# EAGLE design BUZZI-46-2 (EAGLE 5.02)
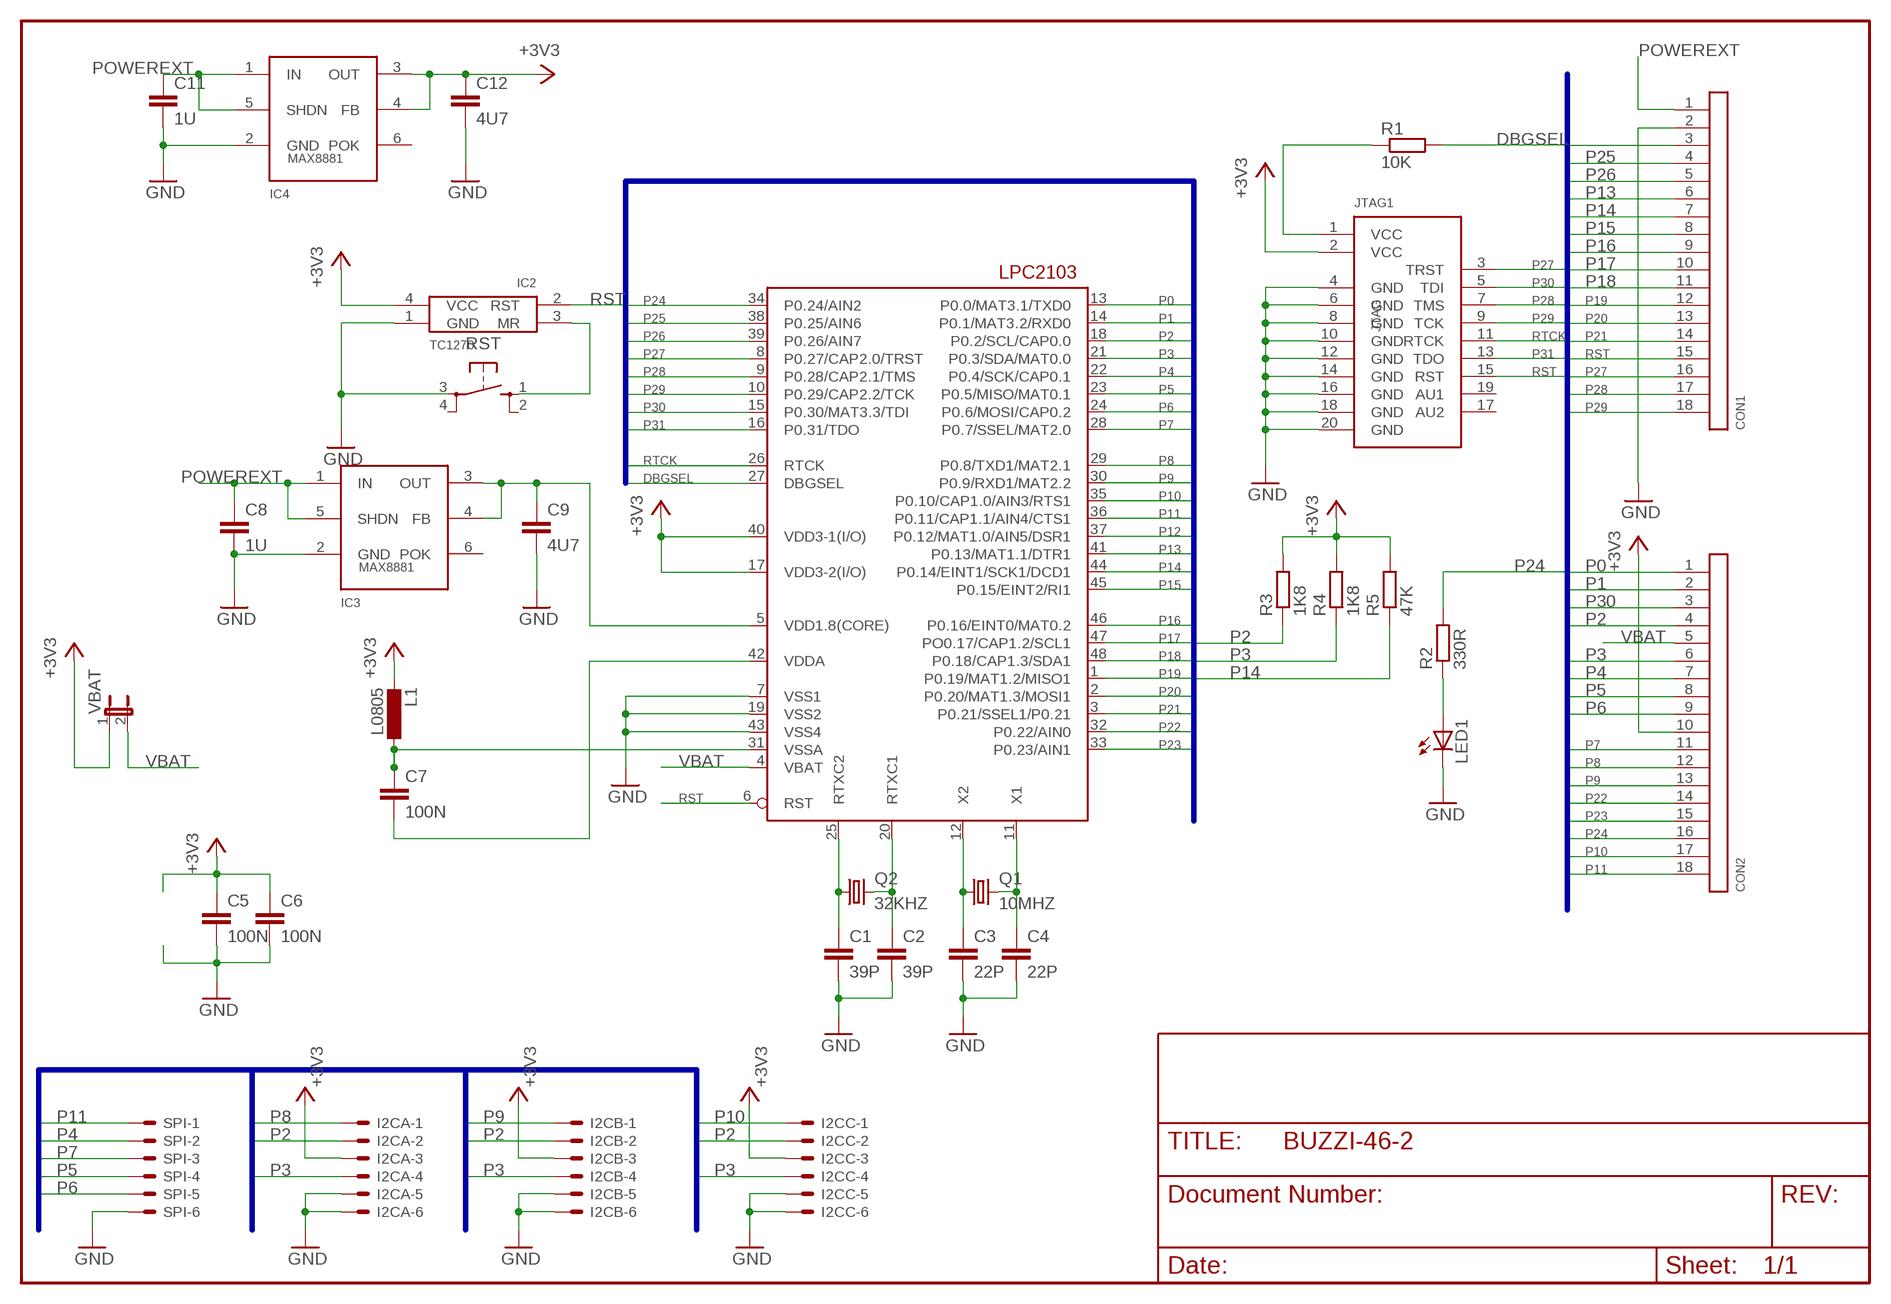
[diagram p0: schematic, sheet 1]

## Parts
C1  39P  C-EUC0603K  [C0603K]
C2  39P  C-EUC0603K  [C0603K]
C3  22P  C-EUC0603K  [C0603K]
C4  22P  C-EUC0603K  [C0603K]
C5  100N  C-EUC0805  [C0805]
C6  100N  C-EUC0805  [C0805]
C7  100N  C-EUC0603  [C0603]
C8  1U  C-EUC0805  [C0805]
C9  4U7  C-EUC0805  [C0805]
C11  1U  C-EUC0805  [C0805]
C12  4U7  C-EUC0805  [C0805]
CON1  CON18  [MA18-1]
CON2  CON18  [MA18-1]
I2CA  22-23-2061  [22-23-2061]
I2CB  22-23-2061  [22-23-2061]
I2CC  22-23-2061  [22-23-2061]
IC1  LPC2103  [LQFP48]
IC2  TC1270  [SOT143R_INFINEON]
IC3  MAX8881-18  MAX8881  [SOT23-6L]
IC4  MAX8881-33  MAX8881  [SOT23-6L]
JTAG1  ARM-JTAGVERTIKAL  [ML20]
L1  L0805  [C0805]
LED1  LEDCHIPLED_0805  [CHIPLED_0805]
Q1  10MHZ  CRYTALHC49S  [HC49/S]
Q2  32KHZ  CRYTALTC26V  [TC26V]
R1  10K  R-EU_M0805  [M0805]
R2  330R  R-EU_M0805  [M0805]
R3  1K8  R-EU_M0805  [M0805]
R4  1K8  R-EU_M0805  [M0805]
R5  47K  R-EU_M0805  [M0805]
RST  10XXSMD  [B3F-10XX-SMD]
SPI  22-23-2061  [22-23-2061]
VBAT  JP1E  [JP1]

## Nets
1V8: C9.1 IC1.5(VDD1.8(CORE)) IC3.3(OUT) IC3.4(FB)
+3V3: C5.1 C6.1 C12.1 CON2.10 I2CA.3 I2CB.3 I2CC.3 IC1.17(VDD3-2(I/O)) IC1.40(VDD3-1(I/O)) IC2.4(VCC) IC4.3(OUT) IC4.4(FB) JTAG1.2(VCC) L1.2 R3.2 R4.2 R5.2 VBAT.1
DBGSEL: IC1.27(DBGSEL) R1.2
GND: C1.2 C2.2 C3.2 C4.2 C5.2 C6.2 C8.2 C9.2 C11.2 C12.2 CON1.2 I2CA.5 I2CA.6 I2CB.5 I2CB.6 I2CC.5 I2CC.6 IC1.7(VSS1) IC1.19(VSS2) IC1.43(VSS4) IC2.1(GND) IC3.2(GND) IC4.2(GND) JTAG1.4(GND) JTAG1.6(GND) JTAG1.8(GND) JTAG1.10(GND) JTAG1.12(GND) JTAG1.14(GND) JTAG1.16(GND) JTAG1.18(GND) JTAG1.20(GND) LED1.C RST.3 SPI.6
N$1: IC2.3(MR) RST.1
N$2: JTAG1.1(VCC) R1.1
N$3: LED1.A R2.1
N$6: C7.1 IC1.31(VSSA) L1.1
N$7: C7.2 IC1.42(VDDA)
P0: CON2.1 IC1.13(P0.0/MAT3.1/TXD0)
P1: CON2.2 IC1.14(P0.1/MAT3.2/RXD0)
P2: CON2.4 I2CA.2 I2CB.2 I2CC.2 IC1.18(P0.2/SCL/CAP0.0) R3.1
P3: CON2.6 I2CA.4 I2CB.4 I2CC.4 IC1.21(P0.3/SDA/MAT0.0) R4.1
P4: CON2.7 IC1.22(P0.4/SCK/CAP0.1) SPI.2
P5: CON2.8 IC1.23(P0.5/MISO/MAT0.1) SPI.4
P6: CON2.9 IC1.24(P0.6/MOSI/CAP0.2) SPI.5
P7: CON2.11 IC1.28(P0.7/SSEL/MAT2.0) SPI.3
P8: CON2.12 I2CA.1 IC1.29(P0.8/TXD1/MAT2.1)
P9: CON2.13 I2CB.1 IC1.30(P0.9/RXD1/MAT2.2)
P10: CON2.17 I2CC.1 IC1.35(P0.10/CAP1.0/AIN3/RTS1)
P11: CON2.18 IC1.36(P0.11/CAP1.1/AIN4/CTS1) SPI.1
P12: CON1.3 IC1.37(P0.12/MAT1.0/AIN5/DSR1)
P13: CON1.6 IC1.41(P0.13/MAT1.1/DTR1)
P14: CON1.7 IC1.44(P0.14/EINT1/SCK1/DCD1) R5.1
P15: CON1.8 IC1.45(P0.15/EINT2/RI1)
P16: CON1.9 IC1.46(P0.16/EINT0/MAT0.2)
P17: CON1.10 IC1.47(PO0.17/CAP1.2/SCL1)
P18: CON1.11 IC1.48(P0.18/CAP1.3/SDA1)
P19: CON1.12 IC1.1(P0.19/MAT1.2/MISO1)
P20: CON1.13 IC1.2(P0.20/MAT1.3/MOSI1)
P21: CON1.14 IC1.3(P0.21/SSEL1/P0.21)
P22: CON2.14 IC1.32(P0.22/AIN0)
P23: CON2.15 IC1.33(P0.23/AIN1)
P24: CON2.16 IC1.34(P0.24/AIN2) R2.2
P25: CON1.4 IC1.38(P0.25/AIN6)
P26: CON1.5 IC1.39(P0.26/AIN7)
P27: CON1.16 IC1.8(P0.27/CAP2.0/TRST) JTAG1.3(TRST)
P28: CON1.17 IC1.9(P0.28/CAP2.1/TMS) JTAG1.7(TMS)
P29: CON1.18 IC1.10(P0.29/CAP2.2/TCK) JTAG1.9(TCK)
P30: CON2.3 IC1.15(P0.30/MAT3.3/TDI) JTAG1.5(TDI)
P31: IC1.16(P0.31/TDO) JTAG1.13(TDO)
POWEREXT: C8.1 C11.1 CON1.1 IC3.1(IN) IC3.5(SHDN) IC4.1(IN) IC4.5(SHDN)
RST: CON1.15 IC1.6(RST) IC2.2(RST) JTAG1.15(RST)
RTCK: IC1.26(RTCK) JTAG1.11(RTCK)
RTXC1: C2.1 IC1.20(RTXC1) Q2.2
RTXC2: C1.1 IC1.25(RTXC2) Q2.1
VBAT: CON2.5 IC1.4(VBAT) VBAT.2
X1: C4.1 IC1.11(X1) Q1.2
X2: C3.1 IC1.12(X2) Q1.1
Unconnected: IC3.6(POK) IC4.6(POK) JTAG1.17(AU2) JTAG1.19(AU1) RST.2 RST.4

## Buses
P[0..31],RST,DBGSEL,RTCK

## Library data of the parts
C1-C9 C11 C12 = turbod3:C-EU: CAPACITOR, European symbol
CON1 CON2 = turbod3:CON18
I2CA I2CB I2CC SPI = con-molex:22-23-2061: .100" (2.54mm) Center Header - 6 Pin
IC1 = turbod3:LPC2103: LPC2101/2102/2103 microcontroler from Philips
IC2 = turbod3:TC1270
IC3 IC4 = turbod3:MAX8881
JTAG1 = turbod3:ARM-JTAG
L1 = turbod3:L
LED1 = led:LED: LED OSRAM: - CHIPLED LG R971, LG N971, LY N971, LG Q971, LY Q971, LO R971, LY R971 LH N974, LH R974 LS Q976, LO Q976, LY Q976 LO Q996 - Hyper CHIPLED LW Q18S LB Q993, LB Q99A, LB R99A - SideLED LS A670, LO A670, LY A670, LG A670, LP A670 LB A673, LV A673, LT A673, LW A673 LH A674 LY A675 LS A676, LA A676, LO A676, LY A676, LW A676 LS A679, LY A679, LG A679 - Hyper Micro SIDELED® LS Y876, LA Y876, LO Y876, LY Y876 LT Y87S - SmartLED LW L88C, LW L88S LB L89C, LB L89S, LG L890 LS L89K, LO L89K, LY L89K LS L896, LA L896, LO L896, LY L896 - TOPLED LS T670, LO T670, LY T670, LG T670, LP T670 LSG T670, LSP T670, LSY T670, LOP T670, LYG T670 LG T671, LOG T671, LSG T671 LB T673, LV T673, LT T673, LW T673 LH T674 LS T676, LA T676, LO T676, LY T676, LB T676, LH T676, LSB T676, LW T676 LB T67C, LV T67C, LT T67C, LS T67K, LO T67K, LY T67K, LW E67C LS E67B, LA E67B, LO E67B, LY E67B, LB E67C, LV E67C, LT E67C LW T67C LS T679, LY T679, LG T679 LS T770, LO T770, LY T770, LG T770, LP T770 LB T773, LV T773, LT T773, LW T773 LH T774 LS E675, LA E675, LY E675, LS T675 LS T776, LA T776, LO T776, LY T776, LB T776 LHGB T686 LT T68C, LB T68C - Hyper Mini TOPLED® LB M676 - Mini TOPLED Santana® LG M470 LS M47K, LO M47K, LY M47K Source: http://www.osram.convergy.de/
Q1 Q2 = turbod3:CRYTAL: CRYSTAL
R1-R5 = turbod3:R-EU_: RESISTOR, European symbol
RST = turbod3:10XX
VBAT = jumper:JP1E: JUMPER

## Board
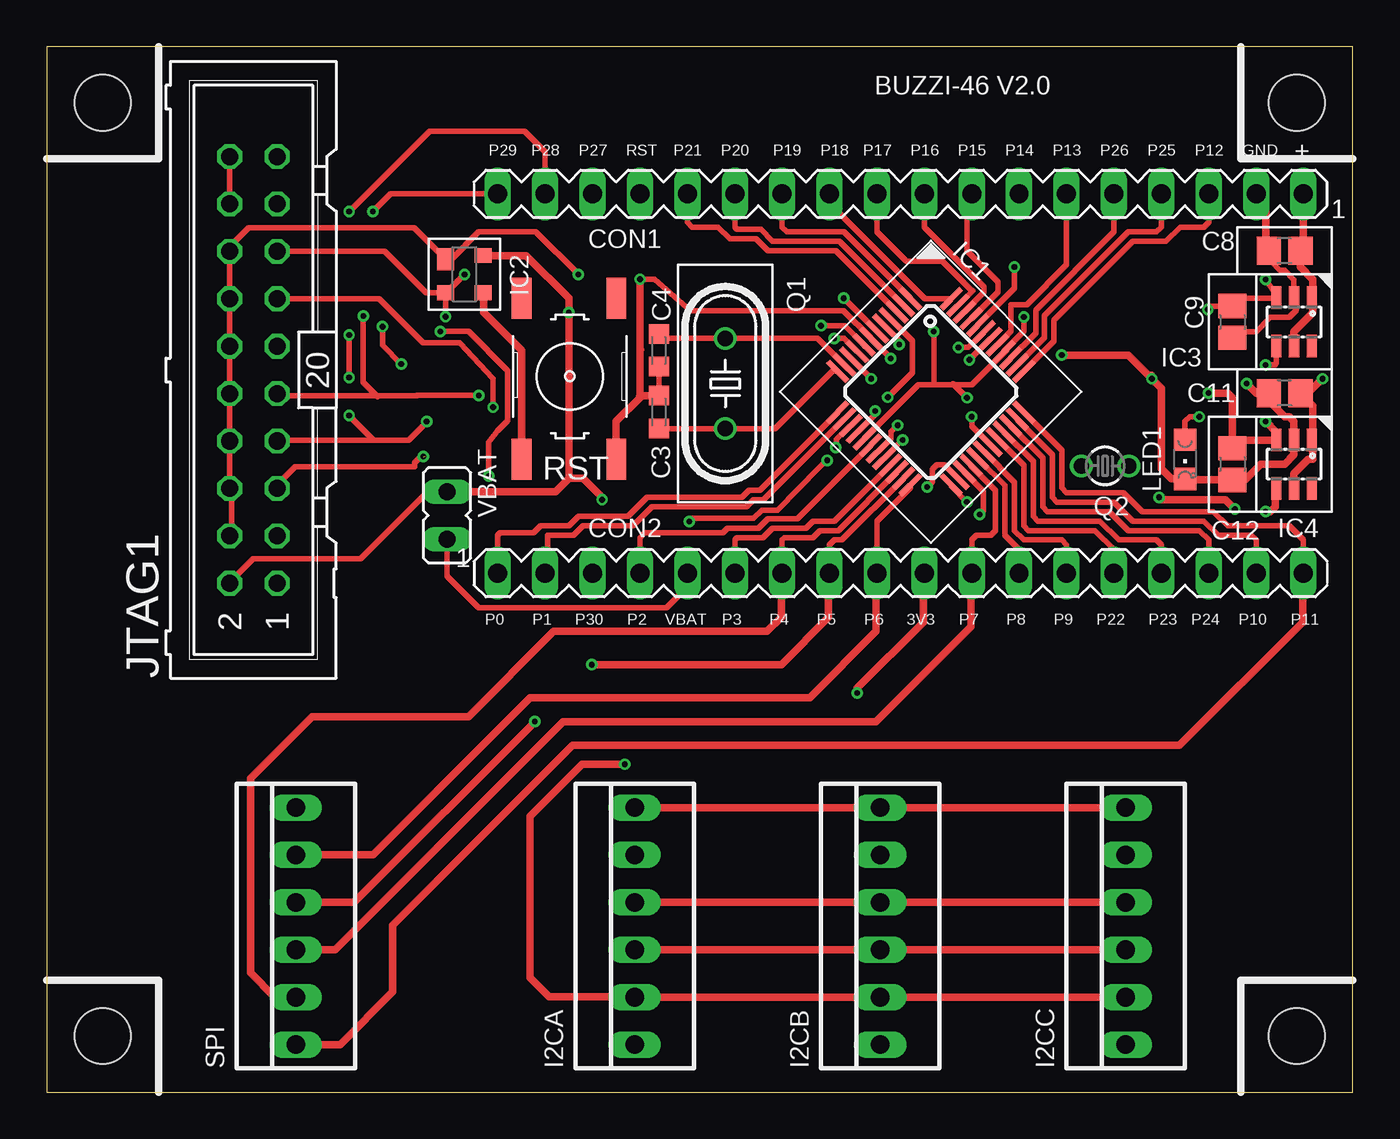
[diagram p1: board, top side]
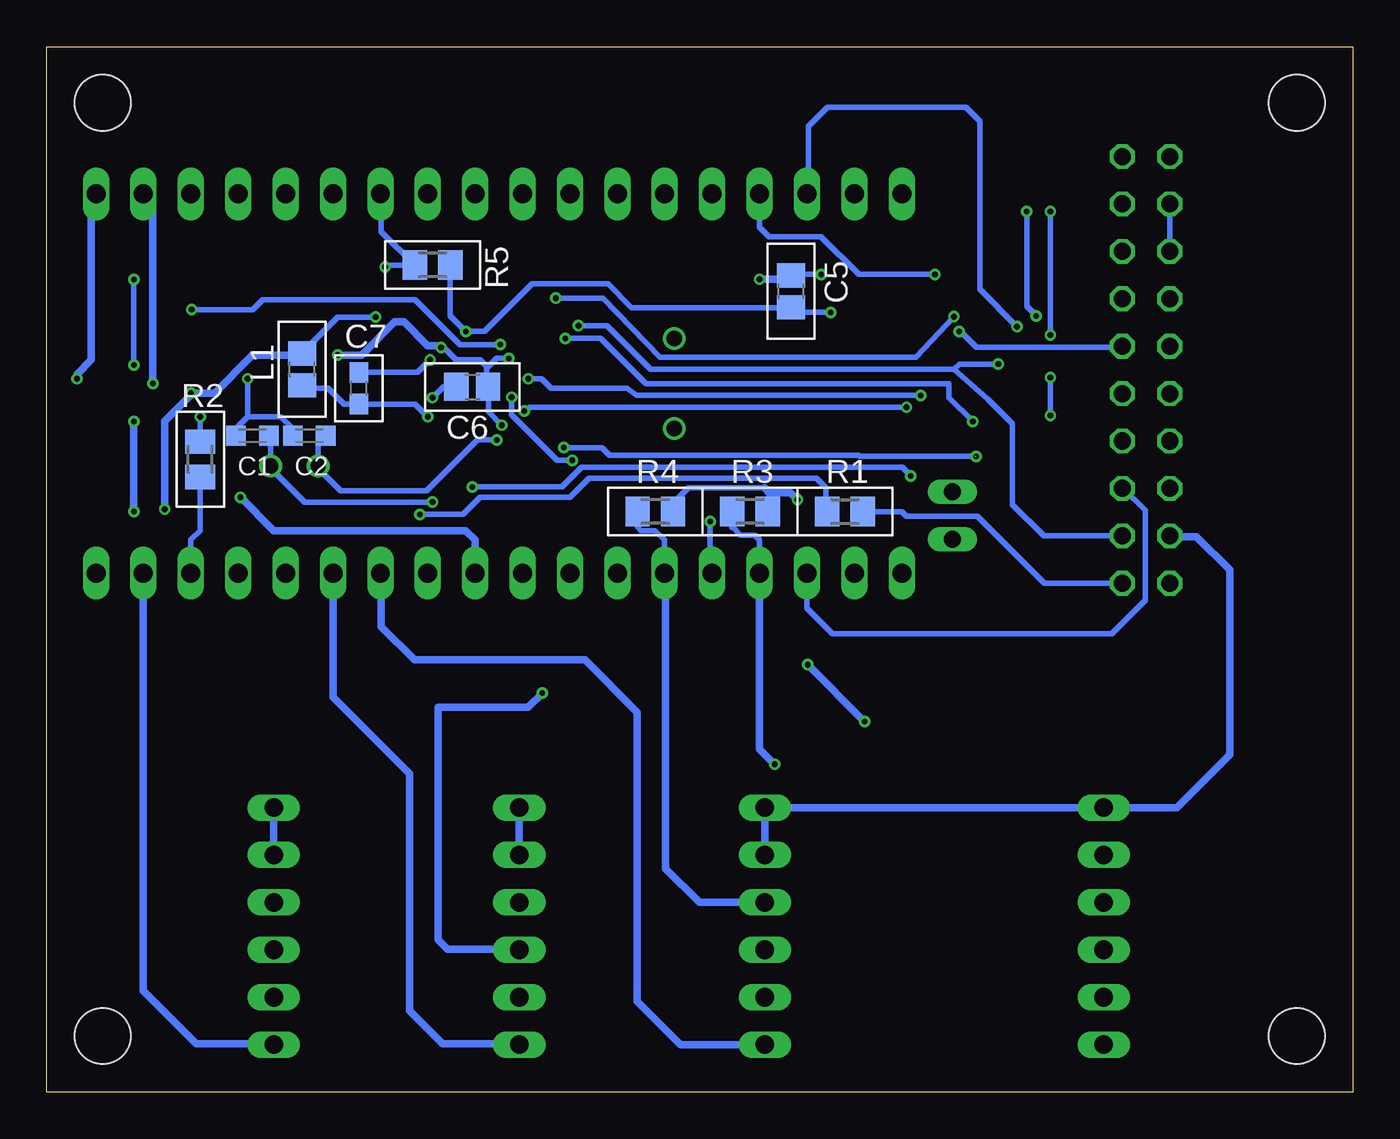
[diagram p2: board, bottom side, seen from below]

Size 70 x 56 mm. Coordinates in mm from the lower left corner, seen from the top.
Outline: 0,0 70,0 70,56 0,56 0,0
Copper layers (1*16): Top 0.035mm / dielectric 1.5mm / Bottom 0.035mm
Design rules "PCB-POOL": minimum track width 6mil, minimum drill 12mil, track to track 6mil, track to pad 6mil, pad to pad 6mil, via to via 6mil, smd to smd 6mil, copper to edge 20mil, drill to drill 8mil, minimum pad ring 8mil, minimum via ring 6mil, stop-mask expansion 3mil, vias tented up to drill 0mil, thermal gap 8mil
Holes 3 mm at 3,53 67,53 67,3 3,3

### Footprints (pad centres in the part's own frame; a part is rotated, then mirrored left to right if it is on the bottom)
C0603K = smd 1.05 x 1.08: 1 -0.875,0; 2 0.875,0
C0805 = smd 1.3 x 1.5: 1 -0.85,0; 2 0.85,0
C0603 = smd 1.1 x 1: 1 -0.85,0; 2 0.85,0
MA18-1 = drill 1.016 long: 1 -24.13,0; 2 -21.59,0; 3 -19.05,0; 4 -16.51,0; 5 -13.97,0; 6 -11.43,0; 7 -8.89,0; 8 -6.35,0; 9 -3.81,0; 10 -1.27,0; 11 1.27,0; 12 3.81,0; 13 6.35,0; 14 8.89,0; 15 11.43,0; 16 13.97,0; 17 16.51,0; 18 19.05,0
22-23-2061 = drill 1 long: 1 -6.35,0; 2 -3.81,0; 3 -1.27,0; 4 1.27,0; 5 3.81,0; 6 6.35,0
LQFP48 = smd 1.5 x 0.3: 1 -4.3,2.75; 2 -4.3,2.25; 3 -4.3,1.75; 4 -4.3,1.25; 5 -4.3,0.75; 6 -4.3,0.25; 7 -4.3,-0.25; 8 -4.3,-0.75; 9 -4.3,-1.25; 10 -4.3,-1.75; 11 -4.3,-2.25; 12 -4.3,-2.75; 25 4.3,-2.75; 26 4.3,-2.25; 27 4.3,-1.75; 28 4.3,-1.25; 29 4.3,-0.75; 30 4.3,-0.25; 31 4.3,0.25; 32 4.3,0.75; 33 4.3,1.25; 34 4.3,1.75; 35 4.3,2.25; 36 4.3,2.75 | smd 0.3 x 1.5: 13 -2.75,-4.3; 14 -2.25,-4.3; 15 -1.75,-4.3; 16 -1.25,-4.3; 17 -0.75,-4.3; 18 -0.25,-4.3; 19 0.25,-4.3; 20 0.75,-4.3; 21 1.25,-4.3; 22 1.75,-4.3; 23 2.25,-4.3; 24 2.75,-4.3; 37 2.75,4.3; 38 2.25,4.3; 39 1.75,4.3; 40 1.25,4.3; 41 0.75,4.3; 42 0.25,4.3; 43 -0.25,4.3; 44 -0.75,4.3; 45 -1.25,4.3; 46 -1.75,4.3; 47 -2.25,4.3; 48 -2.75,4.3
SOT143R_INFINEON = smd 1.2 x 0.9: 1 -0.8,-1 | smd 0.8 x 0.9: 2 1,-1; 3 1,1; 4 -1,1
SOT23-6L = smd 0.55 x 1.2: 1 -0.95,-1.3; 2 0,-1.3; 3 0.95,-1.3; 4 0.95,1.3; 5 0,1.3; 6 -0.95,1.3
ML20 = drill 0.914 octagon: 1 -11.43,-1.27; 2 -11.43,1.27; 3 -8.89,-1.27; 4 -8.89,1.27; 5 -6.35,-1.27; 6 -6.35,1.27; 7 -3.81,-1.27; 8 -3.81,1.27; 9 -1.27,-1.27; 10 -1.27,1.27; 11 1.27,-1.27; 12 1.27,1.27; 13 3.81,-1.27; 14 3.81,1.27; 15 6.35,-1.27; 16 6.35,1.27; 17 8.89,-1.27; 18 8.89,1.27; 19 11.43,-1.27; 20 11.43,1.27
CHIPLED_0805 = smd 1.2 x 1.2: A 0,-1.05; C 0,1.05
HC49/S = drill 0.813 round: 1 -2.413,0; 2 2.413,0
TC26V = drill 0.813 round: 1 -1.27,0; 2 1.27,0
M0805 = smd 1.3 x 1.6: 1 -0.95,0; 2 0.95,0
B3F-10XX-SMD = smd 2.184 x 1.067: 1 -4.572,2.54; 2 4.064,2.54; 3 -4.572,-2.54; 4 4.064,-2.54
JP1 = drill 0.914 long: 1 0,-1.27; 2 0,1.27

### Placement (x,y rotation side)
C1  58.97,35.16 180 bottom
C2  55.93,35.16 180 bottom
C3  32.81,36.43 90 top
C4  32.81,39.73 270 top
C5  30.11,42.89 90 bottom
C6  47.19,37.78 0 bottom
C7  53.26,37.7 90 bottom
C8  66.34,45.07 180 top
C9  63.55,41.26 270 top
C11  66.34,37.45 180 top
C12  63.55,33.64 270 top
CON1  43.23,48.11 180 top
CON2  48.31,27.79 0 top
I2CA  31.51,8.89 90 top
I2CB  44.67,8.89 90 top
I2CC  57.83,8.89 90 top
IC1  47.38,37.51 315 top
IC2  22.38,43.81 270 top
IC3  66.85,41.26 180 top
IC4  66.85,33.64 180 top
JTAG1  11.08,38.68 90 top
L1  56.31,38.72 90 bottom
LED1  61.01,33.89 180 top
Q1  36.37,37.95 90 top
Q2  56.72,33.54 180 top
R1  27.22,31.1 180 bottom
R2  61.77,33.89 270 bottom
R3  32.3,31.1 0 bottom
R4  37.38,31.1 0 bottom
R5  49.32,44.3 0 bottom
RST  27.99,38.46 90 top
SPI  13.35,8.89 90 top
VBAT  21.46,30.89 180 top

### Tracks (layer width: path | path; a pad name or v marks a point on that pad's centre or on a via)
1V8  (via drill 0.3)
  Top 0.305: 63.55,42.09 63.55,42.51 65.87,42.51 IC3.3 65.93,42.67 v65.32,43.53 | 66.03,40.03 IC3.4 65.9,39.04 65.83,38.97 65.32,38.97 v65.32,38.95 | IC1.5 45.69,40.26 v45.69,40.04 | 63.55,42.09 C9.1 | v62.23,41.92 62.4,42.09 63.55,42.09
  Bottom 0.305: v65.32,43.53 v65.32,38.95 | v45.69,40.04 47.85,40.04 50.26,42.45 58.41,42.45 58.95,41.92 v62.23,41.92
+3V3  (via drill 0.3)
  Top 0.305: IC1.17 43.83,35 46.71,37.88 47.54,37.88 | 51.36,39.66 51.46,39.76 | 51.36,39.66 IC1.40 51.31,39.68 52.37,40.75 v52.37,41.51 | 47.54,37.88 48.56,37.88 | 48.56,37.88 49.58,37.88 51.36,39.66 | v47.54,40.75 47.54,37.88 | 27.48,32.37 27.43,32.31 | 23.92,44.81 23.67,44.81 IC2.4 | 48.56,37.88 48.56,37.95 v49.32,37.19 | 20.93,32.16 VBAT.1 21.76,32.11 20.37,32.11 16.82,28.57 11.08,28.57 9.81,27.3 | 29.76,31.86 v29.76,31.73
  Top 0.406: 27.99,32.87 27.48,32.37 27.27,32.16 VBAT.1 | 27.99,32.87 v27.99,41.76 27.99,42.53 25.7,44.81 23.67,44.81 | v65.32,35.92 65.9,35.35 IC4.3 65.85,34.92 65.83,34.91 64.05,34.91 63.65,34.5 C12.1 63.55,37.19 63.29,37.45 v62.28,37.45 | v65.32,31.1 65.58,31.1 65.83,31.35 65.83,32.11 65.9,32.18 IC4.4 | 29.76,31.86 28.75,32.87 27.99,32.87 | v59.61,31.86 59.74,31.73 63.16,31.73 v63.67,31.22 | JTAG1.2 9.81,27.2 | JTAG1.2 | JTAG1.2 9.81,27.3 | I2CB.3 I2CA.3 | I2CB.3 44.93,7.62 44.96,7.65 | 58.13,7.62 I2CC.3 | I2CB.3 58.13,7.62 | 58.13,7.62 58.17,7.65 | v43.43,21.37 43.43,21.62 46.99,25.18 46.99,27.97 47.04,27.93 CON2.10
  Bottom 0.305: L1.2 56.31,39.6 54.4,41.51 v52.37,41.51 | 30.27,42.02 30.25,42.04 C5.1 | v27.99,41.76 30.02,41.76 30.27,42.02 | 30.27,42.02 38.65,42.02 39.92,43.29 43.99,43.29 46.53,40.75 v47.54,40.75 48.38,41.59 48.38,44.31 | 48.38,44.31 48.38,44.33 | 48.38,44.31 R5.2 | C6.1 48.74,37.78 v49.32,37.19 | R4.2 36.43,31.54 35.61,32.37 31.54,32.37 | R3.2 31.29,31.35 31.29,32.11
  Bottom 0.406: v65.32,35.92 v65.32,31.1 | L1.2 56.27,39.57 56.18,39.48 58.97,39.48 61.01,37.45 v62.28,37.45 62.28,37.32 63.67,35.92 v63.67,31.22 | CON2.10 47.04,29.57 47.54,30.08 57.83,30.08 v59.61,31.86 | 31.54,32.37 31.29,32.11 30.14,32.11 v29.76,31.73 | I2CB.3 44.7,7.65 48.51,7.65 49.02,8.16 49.02,20.61 44.2,20.61 v43.43,21.37
DBGSEL  (via drill 0.3)
  Top 0.305: IC1.27 49.16,33.24 50.21,32.19 50.21,31.15 v50.01,30.94
  Bottom 0.305: v50.01,30.94 47.7,30.94 46.78,31.86 41.96,31.86 40.94,32.87 28.75,32.87 28.24,32.37 28.24,31.35 R1.2 28.17,31.54 28.24,31.6
GND  (via drill 0.3)
  Top 0.305: C9.2 63.67,40.6 63.55,40.73 64.82,40.73 65.58,41.49 66.59,41.49 66.97,41.88 IC3.2 66.94,42.67 66.85,42.76 66.85,43.53 66.34,44.03 66.09,44.03 65.62,44.5 C8.2 | C3.2 C4.2 | v28.49,43.8 26.21,46.08 23.16,46.08 21.69,44.61 IC2.1 19.7,46.3 10.82,46.3 9.81,45.28 9.81,44.88 | v31.8,43.54 32.58,43.54 34.51,41.87 42.69,41.87 44.16,40.39 IC1.7 v45.23,39.3 | IC1.19 44.54,34.29 45.23,35.01 45.23,35.36 v45.61,35.72 | IC1.43 49.41,39.88 v48.87,39.88 | 65.59,36.92 65.59,37.43 | v59.23,38.21 59.23,38.46 58.97,38.46 | JTAG1.4 9.91,29.89 9.91,32.43 JTAG1.6 JTAG1.8 JTAG1.10 JTAG1.12 | JTAG1.12 9.81,40 | JTAG1.12 | JTAG1.12 JTAG1.14 9.81,44.88 | JTAG1.20 9.81,50.21 | JTAG1.20 | JTAG1.18 JTAG1.20 | 9.81,44.88 JTAG1.16
  Top 0.406: C8.2 65.56,45.05 65.58,45.07 65.32,45.32 65.32,47.61 CON1.2 | RST.3 30.53,35.92 31.8,37.19 31.8,37.27 | 32.81,37.19 C3.2 31.81,37.3 31.77,37.27 31.8,37.27 | C4.2 32.67,38.86 | v31.8,43.54 31.8,39.76 | 31.8,39.76 31.8,39.73 | v64.31,37.95 64.83,37.43 C11.2 65.59,37.43 | 66.85,34.91 66.85,34.65 | 66.85,34.91 IC4.2 | 66.85,34.91 66.85,34.14 66.34,33.64 65.07,33.64 64.24,32.8 C12.2 61.09,32.79 61.01,32.87 LED1.C 60.28,32.84 59.74,33.38 59.74,37.7 v59.23,38.21 58.97,38.46 57.96,39.48 v54.4,39.48 | 65.59,36.92 66.34,36.18 66.59,36.18 66.85,35.92 66.85,34.91 | 31.8,39.76 31.82,39.76 31.8,39.73 | 31.8,39.73 31.8,37.27 | I2CA.6 I2CB.6 I2CC.6
  Bottom 0.305: C2.2 56.8,35.53 57.45,36.18 59.23,36.18 | 59.23,36.18 59.74,35.67 59.74,35.16 C1.2 | JTAG1.16 JTAG1.18 | C5.2 30.22,43.74 30.27,43.8 v28.49,43.8 | v45.23,39.3 45.89,39.3 46.43,38.77 | 46.43,38.77 46.43,37.73 46.38,37.67 46.34,37.71 C6.2 46.33,37.76 46.33,36.43 v45.61,35.72 | v59.23,38.21 59.23,36.18 | 46.43,38.77 46.43,38.87 46.78,39.22 48.05,39.22 48.81,39.99
  Bottom 0.406: 30.07,43.74 30.02,43.8 | C5.2 30.07,43.74 | v31.8,43.54 30.27,43.54 30.07,43.74 | v64.31,37.95 64.31,47.61 CON1.2 | v54.4,39.48 53.13,39.48 51.35,41.26 50.85,41.26 49.58,39.99 48.81,39.99 48.87,39.94 v48.87,39.88 | 44.7,15.27 I2CB.6 44.67,13.02 44.96,12.73 44.93,12.7 I2CB.5 | 57.91,15.27 57.88,15.24 I2CC.6 57.83,12.56 | 57.83,12.56 I2CC.5 | 57.83,12.56 57.91,12.48 | I2CA.5 31.72,12.7 31.75,12.73 31.51,12.97 I2CA.6 31.51,15.26 31.5,15.27 31.46,15.24 SPI.6 9.43,15.24 6.6,18.07 6.6,27.97 8.38,29.75 9.65,29.75 9.7,29.79 JTAG1.4
N$1
  Top 0.406: RST.1 25.45,39.73 23.41,41.76 23.41,42.78 IC2.3
N$2
  Bottom 0.305: R1.1 24.18,31.1 23.92,30.84 20.11,30.84 16.52,27.25 JTAG1.1
  Bottom 0.406: JTAG1.1
N$3  (via drill 0.3)
  Top 0.305: v61.77,36.18 61.26,36.18 61.01,35.92 LED1.A
  Bottom 0.305: 61.45,34.84 R2.1 v61.77,36.18
N$6  (via drill 0.3)
  Top 0.305: IC1.31 50.85,34.4 | IC1.31 | v49.58,36.18 49.58,35.67 IC1.31
  Bottom 0.305: C7.1 53.22,36.85 53.13,36.94 | C7.1 50.25,36.85 v49.58,36.18 | C7.1 54.06,36.85 54.91,37.7 56.43,37.7
  Bottom 0.406: 56.43,37.7 56.31,37.83 L1.1
N$7  (via drill 0.3)
  Top 0.305: IC1.42 v49.45,39.22
  Bottom 0.305: v49.45,39.22 50.12,38.55 C7.2 53.26,38.59 53.3,38.55
P0
  Top 0.305: IC1.13 38.22,32.24 37.64,32.24 37.26,31.86 32.18,31.86 31.16,30.84 28.49,30.84 27.99,30.33 26.46,30.33 26.08,29.95 24.3,29.95 24.18,29.83 CON2.1
P1
  Top 0.305: IC1.14 38.42,31.73 37.89,31.73 37.51,31.35 32.43,31.35 31.41,30.33 28.75,30.33 28.24,29.83 26.84,29.83 26.84,27.92 CON2.2
P2  (via drill 0.3)
  Top 0.305: IC1.18 40.23,30.71 38.65,30.71 38.15,30.21 36.49,30.21 36.24,29.95 32.05,29.95 31.8,29.7 CON2.4
  Top 0.406: I2CB.2 I2CA.2 31.51,5.1 31.5,5.11 26.92,5.11 25.91,6.13 25.91,14.76 28.7,17.56 v30.99,17.56 | I2CB.2 44.7,5.11 | 57.88,5.08 I2CC.2 | I2CB.2 57.88,5.08 | 57.88,5.08 57.91,5.11
  Bottom 0.305: 33.25,30.27 32.81,29.83 32.05,29.83 31.8,29.57 CON2.4
  Bottom 0.406: 33.25,30.27 R3.1 | CON2.4 31.8,18.37 v30.99,17.56
P3
  Top 0.305: IC1.21 42.23,30.59 41.07,30.59 40.69,30.21 38.91,30.21 38.4,29.7 37,29.7 36.88,29.57 CON2.6
  Top 0.406: I2CA.4 I2CB.4 | I2CB.4 44.93,10.16 44.96,10.19 | 57.88,10.16 I2CC.4 | I2CB.4 57.88,10.16 | 57.88,10.16 57.91,10.19
  Bottom 0.305: R4.1 38.33,30.27 38.15,30.08 37.38,30.08 36.88,29.57 CON2.6
  Bottom 0.406: I2CA.4 35.02,10.16 36.83,11.97 36.83,27.46 37.08,27.72 37.01,27.79 CON2.6
P4
  Top 0.305: IC1.22 42.43,30.08 41.45,30.08 41.07,29.7 39.54,29.7 39.42,29.57 CON2.7
  Top 0.406: SPI.2 12.22,5.08 10.92,6.38 10.92,16.8 14.22,20.1 22.61,20.1 27.18,24.67 38.61,24.67 39.37,25.43 39.37,27.72 39.42,27.76 CON2.7
P5  (via drill 0.3)
  Top 0.305: IC1.23 42.63,29.57 42.21,29.57 41.96,29.32 CON2.8 41.96,27.54
  Top 0.406: SPI.4 16.48,10.16 v26.16,19.84 | v29.21,22.89 39.37,22.89 41.91,25.43 41.91,27.72 41.96,27.76 CON2.8
  Bottom 0.406: v26.16,19.84 v29.21,22.89 | 41.91,27.72 41.96,27.76 CON2.8
P6
  Top 0.305: IC1.24 46.29,32.38 44.5,30.59 CON2.9
  Top 0.406: SPI.5 17.49,12.7 25.91,21.11 40.89,21.11 44.45,24.67 44.45,27.72 44.5,27.76 CON2.9
P7
  Top 0.305: IC1.28 49.54,33.55 50.85,32.24 50.85,30.08 50.59,29.83 49.83,29.83 49.58,29.57 CON2.11
  Top 0.406: SPI.3 15.46,7.62 27.69,19.84 44.45,19.84 49.53,24.92 49.53,27.72 49.58,27.76 CON2.11
P8
  Top 0.305: IC1.29 50.02,33.83 51.35,32.49 51.35,29.83 52.12,29.06 CON2.12
  Bottom 0.406: I2CA.1 36.04,2.54 38.35,4.86 38.35,20.35 41.15,23.15 50.29,23.15 52.07,24.92 52.07,27.97 52.12,27.93 CON2.12
P9
  Top 0.305: IC1.30 51.86,32.67 51.86,30.08 52.37,29.57 54.4,29.57 54.66,29.32 CON2.13
  Bottom 0.406: CON2.13 54.66,21.16 50.55,17.05 50.55,4.35 48.77,2.57 44.7,2.57 I2CB.1
P10
  Top 0.305: IC1.35 52.01,36.02 53.89,34.14 53.89,31.86 54.15,31.6 57.2,31.6 58.21,30.59 62.02,30.59 62.78,29.83 64.56,29.83 64.82,29.57 64.82,27.76 | 64.82,27.76 CON2.17 | 64.82,27.76 64.77,27.72
  Bottom 0.406: I2CC.1 57.69,2.54 57.66,2.57 61.98,2.57 64.82,5.41 64.82,27.51 65.02,27.72 64.95,27.79 CON2.17
P11
  Top 0.305: IC1.36 54.4,34.38 54.4,32.37 54.66,32.11 57.7,32.11 58.72,31.1 62.53,31.1 63.29,30.33 66.59,30.33 67.36,29.57 CON2.18
  Top 0.406: CON2.18 67.36,27.93 67.31,27.97 67.31,25.18 60.71,18.57 28.19,18.57 18.54,8.92 18.54,5.37 15.72,2.54 SPI.1
P12
  Top 0.305: IC1.37 53.97,40.21 53.97,41.33 58.21,45.57 59.99,45.57 60.75,46.34 62.02,46.34 62.28,46.59 CON1.3
P13
  Top 0.305: IC1.41 51.68,40.75 51.68,42.17 52.52,42.17 54.66,44.3 CON1.6
P14  (via drill 0.3)
  Top 0.305: IC1.44 51.86,43.05 v51.86,44.2
  Bottom 0.305: v51.86,44.2 51.79,44.28 50.29,44.28 50.29,44.29 R5.1 52.06,46.1 52.06,48.06 CON1.7
P15
  Top 0.305: IC1.45 50.97,42.86 50.97,43.41 49.32,45.07 49.32,47.86 CON1.8
P16
  Top 0.305: IC1.46 49.19,41.8 50.24,42.86 50.24,43.14 47.04,46.34 CON1.9
P17
  Top 0.305: IC1.47 49.63,42.93 49.58,42.93 48,44.51 46.07,44.51 44.5,46.08 CON1.10
P18
  Top 0.305: IC1.48 47.07,42.49 41.96,47.61
  Top 0.406: CON1.11 41.96,47.61
P19
  Top 0.305: IC1.1 46.29,42.51 42.72,46.08 39.67,46.08 39.42,46.34 CON1.12
P20
  Top 0.305: IC1.2 46.03,42.04 42.49,45.57 38.91,45.57 38.27,46.21 37,46.21 36.88,46.34 CON1.13
P21
  Top 0.305: IC1.3 45.53,41.82 42.29,45.07 38.65,45.07 38.02,45.7 36.62,45.7 35.99,46.34 34.59,46.34 34.34,46.59 CON1.14
P22
  Top 0.305: IC1.32 52.37,33.58 52.37,30.33 52.62,30.08 56.18,30.08 57.2,29.06 CON2.14
P23
  Top 0.305: IC1.33 52.88,33.78 52.88,30.84 53.13,30.59 56.43,30.59 57.45,29.57 59.48,29.57 59.74,29.32 CON2.15
P24
  Top 0.305: IC1.34 53.39,33.98 53.39,31.35 53.64,31.1 56.94,31.1 57.96,30.08 61.77,30.08 62.28,29.57 CON2.16
  Bottom 0.305: R2.2 61.77,30.08 62.28,29.57 CON2.16
P25
  Top 0.305: IC1.38 53.46,40.41 53.46,41.59 57.96,46.08 59.48,46.08 59.74,46.34 CON1.4
P26
  Top 0.305: IC1.39 53.01,40.66 53.01,41.89 57.2,46.08 CON1.5
P27  (via drill 0.3)
  Top 0.305: IC1.8 | IC1.8 43.89,39.94 | v41.5,41.05 42.77,41.05 IC1.8 | v19,39 18,40 v18,41
  Bottom 0.305: v41.5,41.05 39.98,41.05 37.64,38.72 21.38,38.72 | 21.38,38.72 19.55,37.12 18.24,35.8 18.24,31.46 16.56,29.79 JTAG1.3 | 21.38,38.72 21.1,39 v19,39 | v18,41 20,43 20,52 20.75,52.75 28.15,52.75 29.16,51.73 29.16,48.18 29.19,48.18 CON1.16
P28  (via drill 0.3)
  Top 0.305: IC1.9 43.45,39.66 42.98,40.13 | 42.98,40.13 42.82,40.29 | v20.37,35.92 20.14,35.67 19.39,34.92 17.48,34.92 | 42.98,40.13 42.97,40.11 42.72,40.37 v42.21,40.37 | 12.3,34.92 12.25,34.92 | JTAG1.7 12.3,34.92 | 12.3,34.92 17.48,34.92 | CON1.17 26.72,50.37 25.61,51.48 20.53,51.48 v16.21,47.16 | v16.21,38.27 v16.21,40.56 | 17.48,34.92 17.48,34.97 v16.21,36.24
  Bottom 0.305: v42.21,40.37 40.3,40.37 37.89,37.95 21.64,37.95 21.64,37.19 v20.37,35.92 | v16.21,40.56 v16.21,47.16 | v16.21,36.24 v16.21,38.27
P29  (via drill 0.3)
  Top 0.305: IC1.10 43.1,39.3 v44.19,38.21 | v23.16,37.32 19.86,37.32 19.85,37.31 17.73,37.31 | JTAG1.9 12.35,37.31 17.73,37.31 | CON1.18 18.43,48.11 v17.48,47.16 | 17.73,37.31 17.73,37.26 16.97,38.02 v16.97,41.57
  Bottom 0.305: v23.16,37.32 38.4,37.32 38.91,37.7 42.97,37.7 43.48,38.21 v44.19,38.21 | v17.48,47.16 17.48,42.08 v16.97,41.57
P30  (via drill 0.3)  (1 unrouted)
  Top 0.305: IC1.15 43.09,35.7 42.34,34.96 v42.29,34.52 | 12.25,32.23 12.25,32.12 | JTAG1.5 12.25,32.23 | 12.25,32.23 12.25,32.43 13.31,33.5 19.72,33.5 19.72,33.72 20.07,34.07 20.09,34.04 v20.19,34.04
  Bottom 0.305: v42.29,34.52 40.23,34.52 39.82,34.12 26.49,34.12 26.44,34.07 20.29,34.07 | CON2.3 29.26,25.92 27.89,24.56 12.91,24.56 11.13,26.33 11.13,31.16 12.35,32.38 | 12.35,32.38 12.4,32.43 | 12.35,32.38 JTAG1.5
P31  (via drill 0.3)
  Top 0.305: IC1.16 43.46,35.37 44.06,35.95 44.39,36.28 v44.39,36.48 | v23.92,36.68 23.92,38.21 22.12,40.14 20.16,40.14 17.81,42.49 JTAG1.13
  Bottom 0.305: v44.39,36.48 44.39,36.45 44.37,36.43 44.12,36.68 v23.92,36.68
POWEREXT  (via drill 0.3)
  Top 0.406: C8.1 67.19,44.2 67.86,43.53 | 67.86,43.53 67.86,42.76 | 67.86,42.76 67.86,42.51 67.83,42.54 IC3.1 67.8,42.7 67.86,42.76 | IC3.5 66.85,40.73 67.86,41.75 67.86,42.76 | 67.86,34.85 IC4.1 | 67.86,34.85 67.86,36.76 C11.1 67.59,37.43 v68.37,38.21 | C8.1 67.34,45.05 | C8.1 67.36,45.22 CON1.1 | 67.86,43.53 67.86,43.54 | 67.86,34.85 67.86,33.89 67.61,33.89 66.85,33.13 IC4.5
  Bottom 0.406: v68.37,38.21 68.37,38.46 67.61,39.22 67.61,47.35 67.36,47.61 CON1.1
RST  (via drill 0.3)
  Top 0.305: IC1.6 v42.72,42.53 | IC2.2 v21.38,41.53 | IC2.2 20.33,42.81 18.12,45.03 JTAG1.15 | IC2.2 21.41,42.81 v22.4,43.8 | JTAG1.15 12.3,45.03 | JTAG1.15
  Bottom 0.305: v42.72,42.53 40.18,42.53 37.13,39.35 23.41,39.35 v21.38,41.53 | CON1.15 31.8,46.34 31.29,45.83 28.49,45.83 26.46,43.8 v22.4,43.8
RTCK  (via drill 0.3)
  Top 0.305: IC1.26 48.1,33.61 47.72,33.61 47.47,33.36 47.47,32.7 v47.19,32.42 | v23.69,33 23.69,34.8 24.18,35.41 24.71,35.95 24.71,38.64 22.6,40.75 v21.1,40.75
  Bottom 0.305: v47.19,32.42 42.39,32.42 41.35,33.46 24.15,33.46 v23.69,33 | v21.1,40.75 21.03,40.75 20.18,39.9 12.3,39.9 JTAG1.11
RTXC1  (via drill 0.3)
  Top 0.305: IC1.20 v45.87,34.93
  Bottom 0.305: v45.87,34.93 46.91,34.93 49.63,32.21 54.25,32.21 55.57,33.54 | 55.57,33.54 55.67,33.64 | 55.57,33.54 Q2.2 55.45,34.87 55.16,35.16 C2.1
RTXC2  (via drill 0.3)
  Top 0.305: IC1.25 48.48,32.45 v49.32,31.6
  Bottom 0.305: v49.32,31.6 56.18,31.6 57.99,33.41 Q2.1 57.99,35.13 57.97,35.15 | 57.97,35.15 57.96,35.16 | 57.97,35.15 C1.1
VBAT  (via drill 0.3)
  Top 0.305: IC1.4 45.23,41.42 46.4,40.24 46.4,38.54 v45.08,37.22 | v41.83,33.84 41.4,33.43 39.16,31.17 38.32,31.17 37.87,30.74 34.62,30.74 v34.44,30.56 | VBAT.2 21.46,27.62 23.14,25.94 33.22,25.94 34.31,27.03 34.31,27.72 34.39,27.79 | 34.39,27.79 34.41,27.82 | 34.39,27.79 CON2.5
  Bottom 0.305: v45.08,37.22 45.08,36.28 42.64,33.84 v41.83,33.84 | CON2.5 34.31,27.79 34.26,27.84 34.44,28.02 v34.44,30.56
X1
  Top 0.305: 42.75,38.94 42.97,38.72 | 42.75,38.94 IC1.11 | 42.75,38.94 41.32,40.37 Q1.2 33.19,40.37 32.81,40.75 C4.1
X2
  Top 0.305: IC1.12 42.32,38.6 42.21,38.72 39.03,35.54 Q1.1 32.94,35.54 32.81,35.67 C3.1

### Text on the board
tNames: BUZZI-46 V2.0 | P29 | P28 | P27 | RST | P21 | P20 | P19 | P18 | P17 | P16 | P15 | P14 | P13 | P26 | P25 | P12 | GND | + | P0 | P1 | P30 | P2 | VBAT | P3 | P4 | P5 | P6 | 3V3 | P7 | P8 | P9 | P22 | P23 | P24 | P10 | P11